# EAGLE schematic me433 2021 (EAGLE 9.6.2)
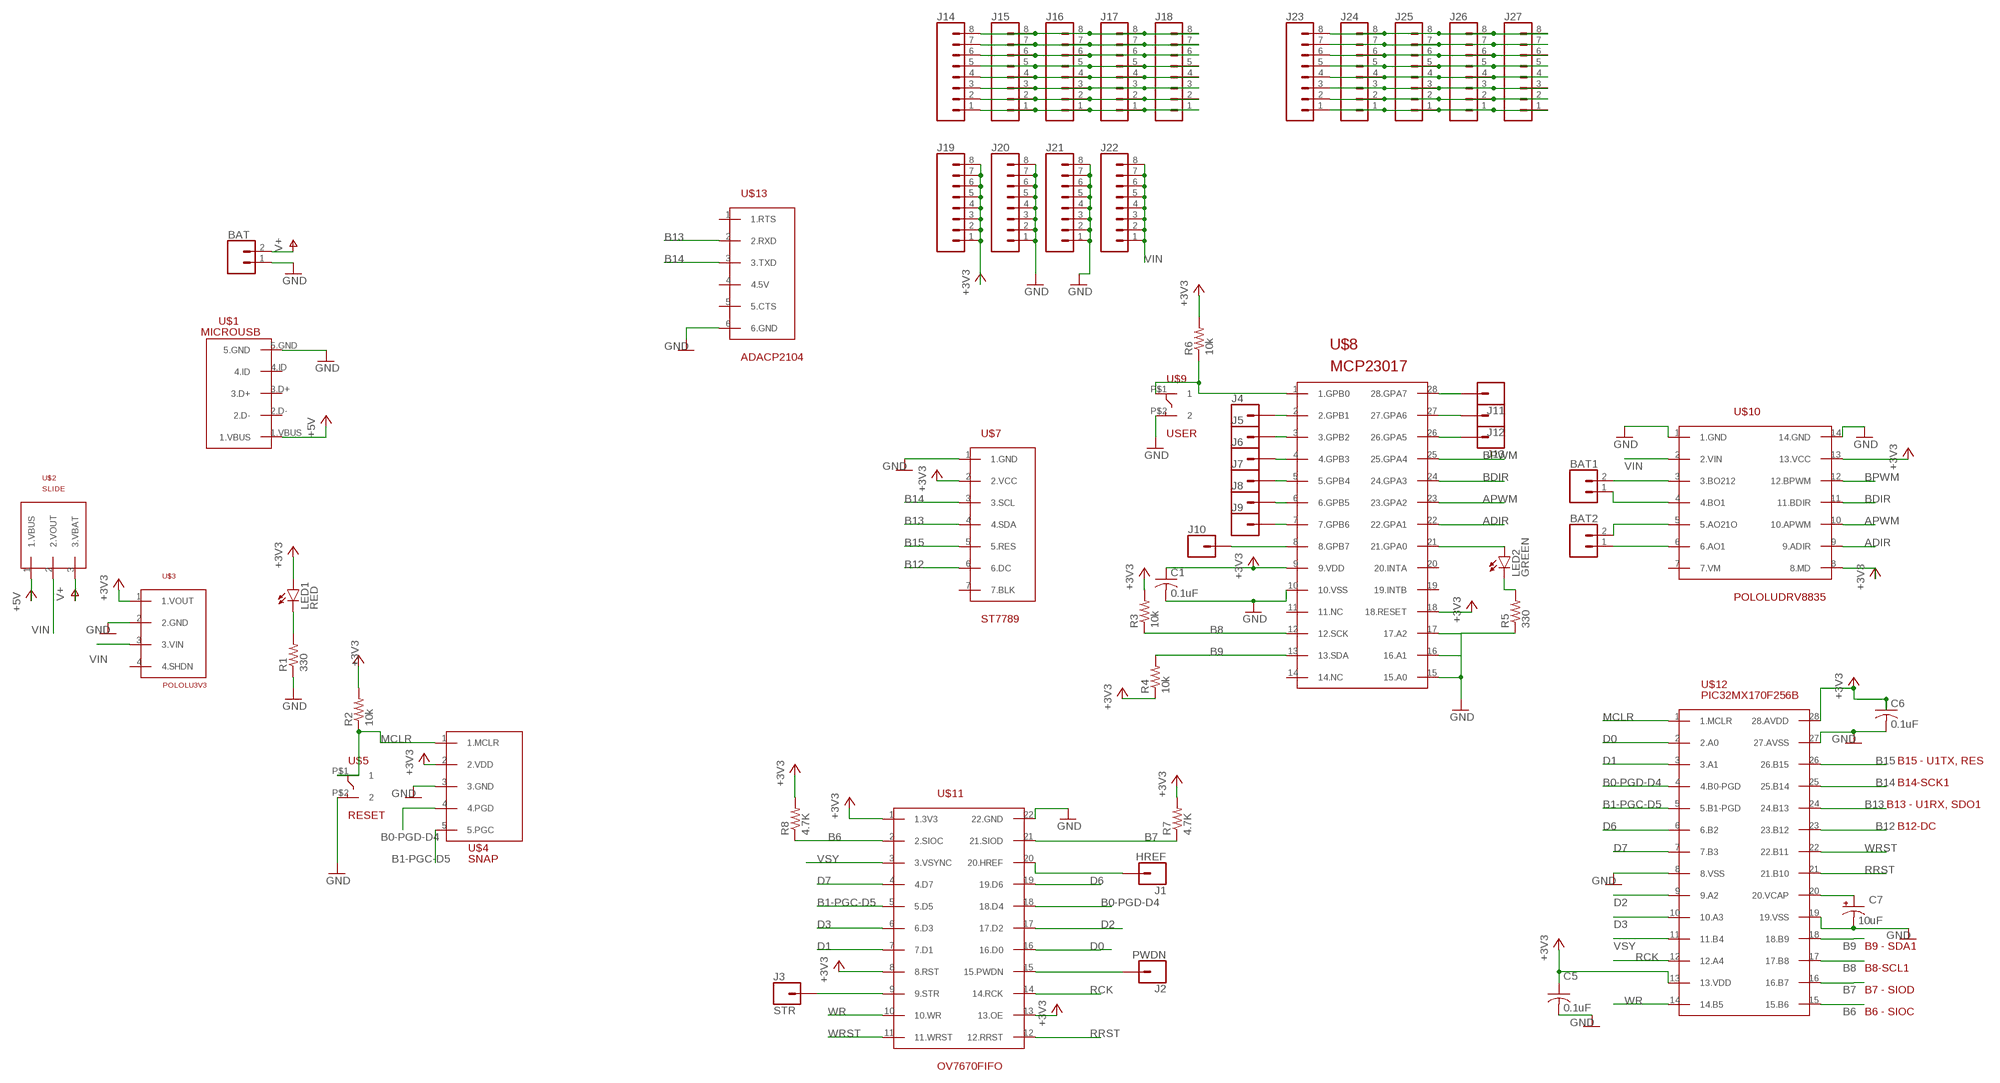
[diagram p0: schematic, sheet 1]

## Parts
BAT  CONN_02  [1X02]
BAT1  CONN_02  [1X02]
BAT2  CONN_02  [1X02]
C1  0.1uF  C-US025-030X050  [C025-030X050]
C5  0.1uF  C-US025-030X050  [C025-030X050]
C6  0.1uF  C-US025-030X050  [C025-030X050]
C7  10uF  CPOL-USB45181B  [B45181B]
J1  HREF  CONN_01  [1X01]
J2  PWDN  CONN_01  [1X01]
J3  STR  CONN_01  [1X01]
J4  CONN_01  [1X01]
J5  CONN_01  [1X01]
J6  CONN_01  [1X01]
J7  CONN_01  [1X01]
J8  CONN_01  [1X01]
J9  CONN_01  [1X01]
J10  CONN_01  [1X01]
J11  CONN_01  [1X01]
J12  CONN_01  [1X01]
J13  CONN_01  [1X01]
J14  CONN_08"  [1X08]
J15  CONN_08"  [1X08]
J16  CONN_08"  [1X08]
J17  CONN_08"  [1X08]
J18  CONN_08"  [1X08]
J19  CONN_08"  [1X08]
J20  CONN_08"  [1X08]
J21  CONN_08"  [1X08]
J22  CONN_08"  [1X08]
J23  CONN_08"  [1X08]
J24  CONN_08"  [1X08]
J25  CONN_08"  [1X08]
J26  CONN_08"  [1X08]
J27  CONN_08"  [1X08]
LED1  RED  LED3MM  [LED3MM]
LED2  GREEN  LED3MM  [LED3MM]
R1  330  R-US_0207/10  [0207/10]
R2  10k  R-US_0207/10  [0207/10]
R3  10k  R-US_0207/10  [0207/10]
R4  10k  R-US_0207/10  [0207/10]
R5  330  R-US_0207/10  [0207/10]
R6  10k  R-US_0207/10  [0207/10]
R7  4.7K  R-US_0207/10  [0207/10]
R8  4.7K  R-US_0207/10  [0207/10]
U$1  MICROUSB  [MICROUSB]
U$2  SLIDE  [SLIDE]
U$3  POLOLU3V3  [POLOLU3V3]
U$4  SNAP  [SNAP]
U$5  RESET  PUSH  [PUSH]
U$7  ST7789  [ST7789]
U$8  MCP23017  [DIL28-3]
U$9  USER  PUSH  [PUSH]
U$10  POLOLUDRV8835  [DIL14]
U$11  OV7670FIFO  [OV7670FIFO]
U$12  PIC32MX170F256B  [DIL28-3]
U$13  ADACP2104  [ADACP2104]

## Nets
+3V3: C1.1 C5.1 C6.1 J19.1 J19.2 J19.3 J19.4 J19.5 J19.6 J19.7 J19.8 LED1.A R2.2 R3.2 R4.1 R6.2 R7.2 R8.2 U$3.1(1.VOUT) U$4.2(2.VDD) U$7.2(2.VCC) U$8.9(9.VDD) U$8.18(18.RESET) U$10.8(8.MD) U$10.13(13.VCC) U$11.1(1.3V3) U$11.8(8.RST) U$11.13(13.OE) U$12.13(13.VDD) U$12.28(28.AVDD)
+5V: U$1.1.VBUS U$2.1(1.VBUS)
ADIR: U$8.22(22.GPA1) U$10.9(9.ADIR)
APWM: U$8.23(23.GPA2) U$10.10(10.APWM)
B0-PGD-D4: U$4.4(4.PGD) U$11.18(18.D4) U$12.4(4.B0-PGD)
B1-PGC-D5: U$4.5(5.PGC) U$11.5(5.D5) U$12.5(5.B1-PGD)
B6: R8.1 U$11.2(2.SIOC) U$12.15(15.B6)
B7: R7.1 U$11.21(21.SIOD) U$12.16(16.B7)
B8: R3.1 U$8.12(12.SCK) U$12.17(17.B8)
B9: R4.2 U$8.13(13.SDA) U$12.18(18.B9)
B12: U$7.6(6.DC) U$12.23(23.B12)
B13: U$7.4(4.SDA) U$12.24(24.B13) U$13.2(2.RXD)
B14: U$7.3(3.SCL) U$12.25(25.B14) U$13.3(3.TXD)
B15: U$7.5(5.RES) U$12.26(26.B15)
BDIR: U$8.24(24.GPA3) U$10.11(11.BDIR)
BPWM: U$8.25(25.GPA4) U$10.12(12.BPWM)
D0: U$11.16(16.D0) U$12.2(2.A0)
D1: U$11.7(7.D1) U$12.3(3.A1)
D2: U$11.17(17.D2) U$12.9(9.A2)
D3: U$11.6(6.D3) U$12.10(10.A3)
D6: U$11.19(19.D6) U$12.6(6.B2)
D7: U$11.4(4.D7) U$12.7(7.B3)
GND: BAT.1 C1.2 C5.2 C6.2 C7.- J20.1 J20.2 J20.3 J20.4 J20.5 J20.6 J20.7 J20.8 J21.1 J21.2 J21.3 J21.4 J21.5 J21.6 J21.7 J21.8 R1.1 R5.1 U$1.5.GND U$3.2(2.GND) U$4.3(3.GND) U$5.P$2 U$7.1(1.GND) U$8.10(10.VSS) U$8.15(15.A0) U$8.16(16.A1) U$8.17(17.A2) U$9.P$2 U$10.1(1.GND) U$10.14(14.GND) U$11.22(22.GND) U$12.8(8.VSS) U$12.19(19.VSS) U$12.27(27.AVSS) U$13.6(6.GND)
MCLR: R2.1 U$4.1(1.MCLR) U$5.P$1 U$12.1(1.MCLR)
N$1: LED1.K(C) R1.2
N$2: J3.1 U$11.9(9.STR)
N$3: R6.1 U$8.1(1.GPB0) U$9.P$1
N$4: LED2.A U$8.21(21.GPA0)
N$5: LED2.K(C) R5.2
N$6: BAT1.2 U$10.3(3.BO212)
N$7: BAT1.1 U$10.4(4.BO1)
N$8: BAT2.2 U$10.5(5.AO21O)
N$9: BAT2.1 U$10.6(6.AO1)
N$10: J2.1 U$11.15(15.PWDN)
N$11: J1.1 U$11.20(20.HREF)
N$12: J4.1 U$8.2(2.GPB1)
N$13: J10.1 U$8.8(8.GPB7)
N$14: J5.1 U$8.3(3.GPB2)
N$15: J6.1 U$8.4(4.GPB3)
N$16: J7.1 U$8.5(5.GPB4)
N$17: C7.+ U$12.20(20.VCAP)
N$18: J8.1 U$8.6(6.GPB5)
N$19: J9.1 U$8.7(7.GPB6)
N$20: J11.1 U$8.28(28.GPA7)
N$21: J12.1 U$8.27(27.GPA6)
N$22: J13.1 U$8.26(26.GPA5)
N$23: J14.8 J15.8 J16.8 J17.8 J18.8
N$24: J14.7 J15.7 J16.7 J17.7 J18.7
N$25: J14.6 J15.6 J16.6 J17.6 J18.6
N$26: J14.5 J15.5 J16.5 J17.5 J18.5
N$27: J14.4 J15.4 J16.4 J17.4 J18.4
N$28: J14.3 J15.3 J16.3 J17.3 J18.3
N$29: J14.2 J15.2 J16.2 J17.2 J18.2
N$30: J14.1 J15.1 J16.1 J17.1 J18.1
N$31: J23.8 J24.8 J25.8 J26.8 J27.8
N$32: J23.7 J24.7 J25.7 J26.7 J27.7
N$33: J23.6 J24.6 J25.6 J26.6 J27.6
N$34: J23.5 J24.5 J25.5 J26.5 J27.5
N$35: J23.4 J24.4 J25.4 J26.4 J27.4
N$36: J23.3 J24.3 J25.3 J26.3 J27.3
N$37: J23.2 J24.2 J25.2 J26.2 J27.2
N$38: J23.1 J24.1 J25.1 J26.1 J27.1
RCK: U$11.14(14.RCK) U$12.12(12.A4)
RRST: U$11.12(12.RRST) U$12.21(21.B10)
V+: BAT.2 U$2.3(3.VBAT)
VIN: J22.1 J22.2 J22.3 J22.4 J22.5 J22.6 J22.7 J22.8 U$2.2(2.VOUT) U$3.3(3.VIN) U$10.2(2.VIN)
VSY: U$11.3(3.VSYNC) U$12.11(11.B4)
WR: U$11.10(10.WR) U$12.14(14.B5)
WRST: U$11.11(11.WRST) U$12.22(22.B11)
Unconnected: U$1.2.D- U$1.3.D+ U$1.4.ID U$3.4(4.SHDN) U$7.7(7.BLK) U$8.11(11.NC) U$8.14(14.NC) U$8.19(19.INTB) U$8.20(20.INTA) U$10.7(7.VM) U$13.1(1.RTS) U$13.4(4.5V) U$13.5(5.CTS)

## Notes on the sheet
- B15 - U1TX, RES
- B14-SCK1
- B13 - U1RX, SDO1
- B12-DC
- B9 - SDA1
- B8-SCL1
- B7 - SIOD
- B6 - SIOC

## Library data of the parts
BAT BAT1 BAT2 = me 433 2021:CONN_02: Multi connection point. Often used as Generic Header-pin footprint for 0.1 inch spaced/style header connections On any of the 0.1 inch spaced packages, you can populate with these: Break Away Headers - Straight <https://www.sparkfun.com/products/116> (PRT-00116) Break Away Male Headers - Right Angle <https://www.sparkfun.com/products/553> (PRT-00553) Female Headers <https://www.sparkfun.com/products/115> (PRT-00115) Break Away Headers - Machine Pin <https://www.sparkfun.com/products/117> (PRT-00117) Break Away Female Headers - Swiss Machine Pin <https://www.sparkfun.com/products/743> (PRT-00743) For SCREWTERMINALS and SPRING TERMINALS visit here: Screw Terimnals on SparkFun.com <https://www.sparkfun.com/search/results?term=Screw+Terminals> (5mm/3.5mm/2.54mm spacing) This device is also useful as a general connection point to wire up your design to another part of your project. Our various solder wires solder well into these plated through hole pads. Hook-Up Wire - Assortment (Stranded, 22 AWG) <https://www.sparkfun.com/products/11375> (PRT-11375) Hook-Up Wire - Assortment (Solid Core, 22 AWG) <https://www.sparkfun.com/products/11367> (PRT-11367) View the entire wire category on our website here <https://www.sparkfun.com/categories/141> Special notes: Molex polarized connector foot print use with: PRT-08233 with associated crimp pins and housings. 2.54_SCREWTERM for use with PRT-10571. 3.5mm Screw Terminal footprints for PRT-08084 5mm Screw Terminal footprints for use with PRT-08432
C1 C5 C6 = me 433 2021:C-US: CAPACITOR, American symbol; SPICEPREFIX: C
C7 = me 433 2021:CPOL-US: POLARIZED CAPACITOR, American symbol; SPICEPREFIX: C
J1-J13 = me 433 2021:CONN_01: Single connection point. Often used as Generic Header-pin footprint for 0.1 inch spaced/style header connections On any of the 0.1 inch spaced packages, you can populate with these: Break Away Headers - Straight <https://www.sparkfun.com/products/116> (PRT-00116) Break Away Male Headers - Right Angle <https://www.sparkfun.com/products/553> (PRT-00553) Female Headers <https://www.sparkfun.com/products/115> (PRT-00115) Break Away Headers - Machine Pin <https://www.sparkfun.com/products/117> (PRT-00117) Break Away Female Headers - Swiss Machine Pin <https://www.sparkfun.com/products/743> (PRT-00743) This device is also useful as a general connection point to wire up your design to another part of your project. Our various solder wires solder well into these plated through hole pads. Hook-Up Wire - Assortment (Stranded, 22 AWG) <https://www.sparkfun.com/products/11375> (PRT-11375) Hook-Up Wire - Assortment (Solid Core, 22 AWG) <https://www.sparkfun.com/products/11367> (PRT-11367) View the entire wire category on our website here <https://www.sparkfun.com/categories/141> Special notes: SMTSO-256-ET is a "flush mount" nut for a 4-40 screw. We mostly use this on specialty testbeds; it is a nice way to connect hardware to your PCB at an adjustable hieght. Also note, the SNAP packages are for using a snappable style connector. We sell a baggie of snaps and they are also used on two LilyPad designs: Snap Assortment - 30 pack (male and female) <https://www.sparkfun.com/products/11347> (DEV-11347) LilyPad Arduino SimpleSnap <https://www.sparkfun.com/products/10941> (DEV-10941) LilyPad SimpleSnap Protoboard <https://www.sparkfun.com/products/10940> (DEV-10940)
J14-J27 = me 433 2021:CONN_08: Multi connection point. Often used as Generic Header-pin footprint for 0.1 inch spaced/style header connections On any of the 0.1 inch spaced packages, you can populate with these: Break Away Headers - Straight <https://www.sparkfun.com/products/116> (PRT-00116) Break Away Male Headers - Right Angle <https://www.sparkfun.com/products/553> (PRT-00553) Female Headers <https://www.sparkfun.com/products/115> (PRT-00115) Break Away Headers - Machine Pin <https://www.sparkfun.com/products/117> (PRT-00117) Break Away Female Headers - Swiss Machine Pin <https://www.sparkfun.com/products/743> (PRT-00743) Arduino Stackable Header - 8 Pin <https://www.sparkfun.com/products/9279> (PRT-09279) For SCREWTERMINALS and SPRING TERMINALS visit here: Screw Terimnals on SparkFun.com <https://www.sparkfun.com/search/results?term=Screw+Terminals> (5mm/3.5mm/2.54mm spacing) This device is also useful as a general connection point to wire up your design to another part of your project. Our various solder wires solder well into these plated through hole pads. Hook-Up Wire - Assortment (Stranded, 22 AWG) <https://www.sparkfun.com/products/11375> (PRT-11375) Hook-Up Wire - Assortment (Solid Core, 22 AWG) <https://www.sparkfun.com/products/11367> (PRT-11367) View the entire wire category on our website here <https://www.sparkfun.com/categories/141> Special notes: Molex polarized connector foot print use with SKU : PRT-08231 with associated crimp pins and housings. 1MM SMD Version SKU: PRT-10208 NOTES ON THE VARIANTS LOCK and LOCK_LONGPADS... This footprint was designed to help hold the alignment of a through-hole component (i.e. 6-pin header) while soldering it into place. You may notice that each hole has been shifted either up or down by 0.005 of an inch from it's more standard position (which is a perfectly straight line). This slight alteration caused the pins (the squares in the middle) to touch the edges of the holes. Because they are alternating, it causes a "brace" to hold the component in place. 0.005 has proven to be the perfect amount of "off-center" position when using our standard breakaway headers. Although looks a little odd when you look at the bare footprint, once you have a header in there, the alteration is very hard to notice. Also,if you push a header all the way into place, it is covered up entirely on the bottom side.; PROD_ID: CONN-08438
LED1 LED2 = me 433 2021:LED: LED OSRAM: - CHIPLED LG R971, LG N971, LY N971, LG Q971, LY Q971, LO R971, LY R971 LH N974, LH R974 LS Q976, LO Q976, LY Q976 LO Q996 - Hyper CHIPLED LW Q18S LB Q993, LB Q99A, LB R99A - SideLED LS A670, LO A670, LY A670, LG A670, LP A670 LB A673, LV A673, LT A673, LW A673 LH A674 LY A675 LS A676, LA A676, LO A676, LY A676, LW A676 LS A679, LY A679, LG A679 - Hyper Micro SIDELED® LS Y876, LA Y876, LO Y876, LY Y876 LT Y87S - SmartLED LW L88C, LW L88S LB L89C, LB L89S, LG L890 LS L89K, LO L89K, LY L89K LS L896, LA L896, LO L896, LY L896 - TOPLED LS T670, LO T670, LY T670, LG T670, LP T670 LSG T670, LSP T670, LSY T670, LOP T670, LYG T670 LG T671, LOG T671, LSG T671 LB T673, LV T673, LT T673, LW T673 LH T674 LS T676, LA T676, LO T676, LY T676, LB T676, LH T676, LSB T676, LW T676 LB T67C, LV T67C, LT T67C, LS T67K, LO T67K, LY T67K, LW E67C LS E67B, LA E67B, LO E67B, LY E67B, LB E67C, LV E67C, LT E67C LW T67C LS T679, LY T679, LG T679 LS T770, LO T770, LY T770, LG T770, LP T770 LB T773, LV T773, LT T773, LW T773 LH T774 LS E675, LA E675, LY E675, LS T675 LS T776, LA T776, LO T776, LY T776, LB T776 LHGB T686 LT T68C, LB T68C - Hyper Mini TOPLED® LB M676 - Mini TOPLED Santana® LG M470 LS M47K, LO M47K, LY M47K Source: http://www.osram.convergy.de LUXEON: - LUMILED® LXK2-PW12-R00, LXK2-PW12-S00, LXK2-PW14-U00, LXK2-PW14-V00 LXK2-PM12-R00, LXK2-PM12-S00, LXK2-PM14-U00 LXK2-PE12-Q00, LXK2-PE12-R00, LXK2-PE12-S00, LXK2-PE14-T00, LXK2-PE14-U00 LXK2-PB12-K00, LXK2-PB12-L00, LXK2-PB12-M00, LXK2-PB14-N00, LXK2-PB14-P00, LXK2-PB14-Q00 LXK2-PR12-L00, LXK2-PR12-M00, LXK2-PR14-Q00, LXK2-PR14-R00 LXK2-PD12-Q00, LXK2-PD12-R00, LXK2-PD12-S00 LXK2-PH12-R00, LXK2-PH12-S00 LXK2-PL12-P00, LXK2-PL12-Q00, LXK2-PL12-R00 Source: www.luxeon.com KINGBRIGHT: KA-3528ASYC Source: www.kingbright.com
R1-R8 = me 433 2021:R-US_: RESISTOR, American symbol; SPICEPREFIX: R
U$1 = me 433 2021:MICROUSB
U$2 = me 433 2021:SLIDE
U$3 = me 433 2021:POLOLU3V3
U$4 = me 433 2021:SNAP
U$5 U$9 = me 433 2021:PUSH
U$7 = me 433 2021:ST7789
U$8 = me 433 2021:MCP23017
U$10 = me 433 2021:POLOLUDRV8835
U$11 = me 433 2021:OV7670FIFO
U$12 = me 433 2021:PIC32MX170F256B
U$13 = me 433 2021:ADACP2104